# EAGLE design PCB_Breakout (EAGLE 7.1.0)
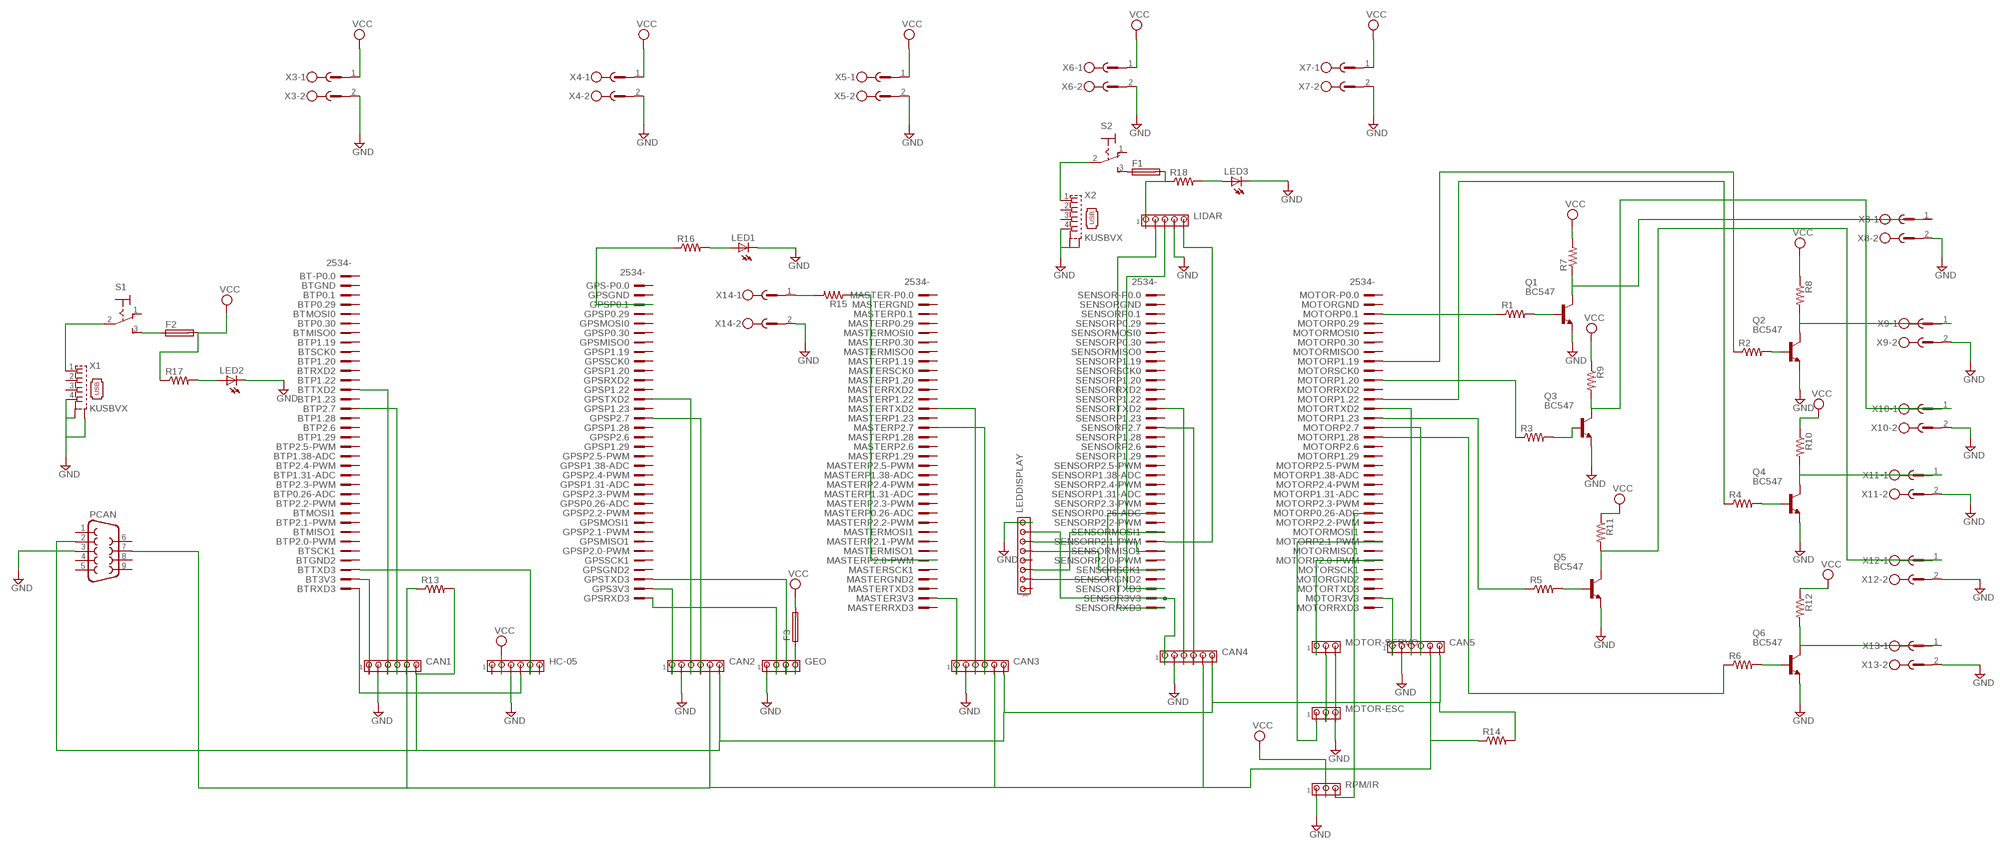
[diagram p0: schematic, sheet 1]

## Parts
BT  2534-  [PAK100/2500-34]
CAN1  MTA06-100  [10X06MTA]
CAN2  MTA06-100  [10X06MTA]
CAN3  MTA06-100  [10X06MTA]
CAN4  MTA06-100  [10X06MTA]
CAN5  MTA06-100  [10X06MTA]
F1  SH22,5  [SH22,5]
F2  SH22,5  [SH22,5]
F3  SH22,5  [SH22,5]
GEO  MTA04-100  [10X04MTA]
GPS  2534-  [PAK100/2500-34]
HC-05  MTA06-100  [10X06MTA]
LED1  LED5MM  [LED5MM]
LED2  LED5MM  [LED5MM]
LED3  LED5MM  [LED5MM]
LEDDISPLAY  MTA08-100  [10X08MTA]
LIDAR  MTA05-100  [10X05MTA]
MASTER  2534-  [PAK100/2500-34]
MOTOR  2534-  [PAK100/2500-34]
MOTOR-ESC  MTA03-100  [10X03MTA]
MOTOR-SERVO  MTA03-100  [10X03MTA]
PCAN  F09HP  [F09HP]
Q1  BC547  [TO92]
Q2  BC547  [TO92]
Q3  BC547  [TO92]
Q4  BC547  [TO92]
Q5  BC547  [TO92]
Q6  BC547  [TO92]
R1  R-US_0207/10  [0207/10]
R2  R-US_0207/10  [0207/10]
R3  R-US_0207/10  [0207/10]
R4  R-US_0207/10  [0207/10]
R5  R-US_0207/10  [0207/10]
R6  R-US_0207/10  [0207/10]
R7  R-US_0207/10  [0207/10]
R8  R-US_0207/10  [0207/10]
R9  R-US_0207/10  [0207/10]
R10  R-US_0207/10  [0207/10]
R11  R-US_0207/10  [0207/10]
R12  R-US_0207/10  [0207/10]
R13  R-US_0207/10  [0207/10]
R14  R-US_0207/10  [0207/10]
R15  R-US_0207/10  [0207/10]
R16  R-US_0207/10  [0207/10]
R17  R-US_0207/10  [0207/10]
R18  R-US_0207/10  [0207/10]
RPM/IR  MTA03-100  [10X03MTA]
S1  M9040P  [M9040P]
S2  M9040P  [M9040P]
SENSOR  2534-  [PAK100/2500-34]
X1  KUSBVX  [KUSBVX]
X2  KUSBVX  [KUSBVX]
X3  MSTBV2  [MSTBV2]
X4  MSTBV2  [MSTBV2]
X5  MSTBV2  [MSTBV2]
X6  MSTBV2  [MSTBV2]
X7  MSTBV2  [MSTBV2]
X8  MSTBV2  [MSTBV2]
X9  MSTBV2  [MSTBV2]
X10  MSTBV2  [MSTBV2]
X11  MSTBV2  [MSTBV2]
X12  MSTBV2  [MSTBV2]
X13  MSTBV2  [MSTBV2]
X14  MSTBV2  [MSTBV2]

## Nets
GND: CAN1.5 CAN2.5 CAN3.5 CAN4.5 CAN5.5 GEO.1 HC-05.4 LED1.K(C) LED2.K(C) LED3.K(C) LEDDISPLAY.8 LIDAR.4 MOTOR-ESC.3 MOTOR-SERVO.3 PCAN.3 Q1.1(E) Q2.1(E) Q3.1(E) Q4.1(E) Q5.1(E) Q6.1(E) RPM/IR.1 X1.4 X1.M1(S1) X1.M2(S2) X2.4 X2.M1(S1) X2.M2(S2) X3.2 X4.2 X5.2 X6.2 X7.2 X8.2 X9.2 X10.2 X11.2 X12.2 X13.2 X14.2
N$1: S2.2(P) X2.1
N$2: BT.33 CAN1.6
N$3: CAN2.6 GPS.33
N$4: CAN3.6 MASTER.33
N$5: CAN4.6 LEDDISPLAY.7 SENSOR.33
N$6: CAN5.6 MOTOR.33
N$7: S1.2(P) X1.1
N$8: F1.2 LIDAR.1 R18.1
N$9: R15.2 X14.1
N$10: MOTOR.3 R1.1
N$11: MOTOR.8 R2.1
N$12: MOTOR.10 R3.1
N$13: MOTOR.12 R4.1
N$14: MOTOR.14 R5.1
N$15: MOTOR.16 R6.1
N$16: Q5.2(B) R5.2
N$17: Q5.3(C) R11.2 X12.1
N$18: Q6.3(C) R12.2 X13.1
N$19: Q6.2(B) R6.2
N$20: Q4.2(B) R4.2
N$21: Q4.3(C) R10.2 X11.1
N$22: Q2.2(B) R2.2
N$23: Q2.3(C) R8.2 X9.1
N$24: Q1.3(C) R7.1 X8.1
N$25: Q1.2(B) R1.2
N$26: Q3.2(B) R3.2
N$27: Q3.3(C) R9.2 X10.1
N$28: MASTER.29 R15.1
N$29: LED2.A R17.2
N$30: BT.13 CAN1.4
N$31: BT.15 CAN1.3
N$32: CAN2.4 GPS.13
N$33: CAN2.3 GPS.15
N$34: CAN3.4 MASTER.13
N$35: CAN3.3 MASTER.15
N$36: CAN4.4 SENSOR.13
N$37: CAN4.3 SENSOR.15
N$38: CAN5.4 MOTOR.13
N$39: CAN5.3 MOTOR.15
N$40: CAN1.2 CAN2.2 CAN3.2 CAN4.2 CAN5.2 PCAN.7 R13.1 R14.1
N$41: LED3.A R18.2
N$42: GPS.3 R16.1
N$43: LED1.A R16.2
N$44: CAN1.1 CAN2.1 CAN3.1 CAN4.1 CAN5.1 PCAN.2 R13.2 R14.2
N$45: F2.1 S1.3(S)
N$46: F1.1 S2.3(S)
N$47: LIDAR.5 SENSOR.27
N$50: MOTOR-SERVO.1 MOTOR.29
N$51: MOTOR-ESC.2 MOTOR-SERVO.2
N$52: MOTOR-ESC.1 MOTOR.27
N$54: MOTOR.24 RPM/IR.3
N$55: LIDAR.2 SENSOR.34
N$56: LIDAR.3 SENSOR.32
N$57: GEO.2 GPS.34
N$58: GEO.3 GPS.32
N$59: BT.34 HC-05.3
N$60: BT.32 HC-05.2
N$64: F3.1 GEO.4
N$65: LEDDISPLAY.2 SENSOR.24
N$66: LEDDISPLAY.3 SENSOR.26
N$67: LEDDISPLAY.5 SENSOR.30
N$68: LEDDISPLAY.6 SENSOR.28
VCC: F2.2 F3.2 HC-05.5 R7.2 R8.1 R9.1 R10.1 R11.1 R12.1 R17.1 RPM/IR.2 X3.1 X4.1 X5.1 X6.1 X7.1
Unconnected: BT.1 BT.2 BT.3 BT.4 BT.5 BT.6 BT.7 BT.8 BT.9 BT.10 BT.11 BT.12 BT.14 BT.16 BT.17 BT.18 BT.19 BT.20 BT.21 BT.22 BT.23 BT.24 BT.25 BT.26 BT.27 BT.28 BT.29 BT.30 BT.31 GPS.1 GPS.2 GPS.4 GPS.5 GPS.6 GPS.7 GPS.8 GPS.9 GPS.10 GPS.11 GPS.12 GPS.14 GPS.16 GPS.17 GPS.18 GPS.19 GPS.20 GPS.21 GPS.22 GPS.23 GPS.24 GPS.25 GPS.26 GPS.27 GPS.28 GPS.29 GPS.30 GPS.31 HC-05.1 HC-05.6 LEDDISPLAY.1 LEDDISPLAY.4 MASTER.1 MASTER.2 MASTER.3 MASTER.4 MASTER.5 MASTER.6 MASTER.7 MASTER.8 MASTER.9 MASTER.10 MASTER.11 MASTER.12 MASTER.14 MASTER.16 MASTER.17 MASTER.18 MASTER.19 MASTER.20 MASTER.21 MASTER.22 MASTER.23 MASTER.24 MASTER.25 MASTER.26 MASTER.27 MASTER.28 MASTER.30 MASTER.31 MASTER.32 MASTER.34 MOTOR.1 MOTOR.2 MOTOR.4 MOTOR.5 MOTOR.6 MOTOR.7 MOTOR.9 MOTOR.11 MOTOR.17 MOTOR.18 MOTOR.19 MOTOR.20 MOTOR.21 MOTOR.22 MOTOR.23 MOTOR.25 MOTOR.26 MOTOR.28 MOTOR.30 MOTOR.31 MOTOR.32 MOTOR.34 PCAN.1 PCAN.4 PCAN.5 PCAN.6 PCAN.8 PCAN.9 S1.1(O) S2.1(O) SENSOR.1 SENSOR.2 SENSOR.3 SENSOR.4 SENSOR.5 SENSOR.6 SENSOR.7 SENSOR.8 SENSOR.9 SENSOR.10 SENSOR.11 SENSOR.12 SENSOR.14 SENSOR.16 SENSOR.17 SENSOR.18 SENSOR.19 SENSOR.20 SENSOR.21 SENSOR.22 SENSOR.23 SENSOR.25 SENSOR.29 SENSOR.31 X1.2 X1.3 X2.2 X2.3

## Library data of the parts
BT GPS MASTER MOTOR SENSOR = con-3m:2534-: 3M (TM) Pak 100 4-Wall Header Source: 3M; OC_FARNELL: unknown; OC_NEWARK: unknown
CAN1-CAN5 HC-05 = con-amp:MTA06-100: AMP connector
F1-F3 = fuse:SH22,5: FUSE HOLDER grid 22,5 mm, OGN0031 8201, Schurter (Buerklin); MF: SCHURTER; MPN: 0031.8201; OC_FARNELL: 1162740; OC_NEWARK: 96F8317
GEO = con-amp:MTA04-100: AMP connector
LED1-LED3 = led:LED: LED OSRAM: - CHIPLED LG R971, LG N971, LY N971, LG Q971, LY Q971, LO R971, LY R971 LH N974, LH R974 LS Q976, LO Q976, LY Q976 LO Q996 - Hyper CHIPLED LW Q18S LB Q993, LB Q99A, LB R99A - SideLED LS A670, LO A670, LY A670, LG A670, LP A670 LB A673, LV A673, LT A673, LW A673 LH A674 LY A675 LS A676, LA A676, LO A676, LY A676, LW A676 LS A679, LY A679, LG A679 - Hyper Micro SIDELED® LS Y876, LA Y876, LO Y876, LY Y876 LT Y87S - SmartLED LW L88C, LW L88S LB L89C, LB L89S, LG L890 LS L89K, LO L89K, LY L89K LS L896, LA L896, LO L896, LY L896 - TOPLED LS T670, LO T670, LY T670, LG T670, LP T670 LSG T670, LSP T670, LSY T670, LOP T670, LYG T670 LG T671, LOG T671, LSG T671 LB T673, LV T673, LT T673, LW T673 LH T674 LS T676, LA T676, LO T676, LY T676, LB T676, LH T676, LSB T676, LW T676 LB T67C, LV T67C, LT T67C, LS T67K, LO T67K, LY T67K, LW E67C LS E67B, LA E67B, LO E67B, LY E67B, LB E67C, LV E67C, LT E67C LW T67C LS T679, LY T679, LG T679 LS T770, LO T770, LY T770, LG T770, LP T770 LB T773, LV T773, LT T773, LW T773 LH T774 LS E675, LA E675, LY E675, LS T675 LS T776, LA T776, LO T776, LY T776, LB T776 LHGB T686 LT T68C, LB T68C - Hyper Mini TOPLED® LB M676 - Mini TOPLED Santana® LG M470 LS M47K, LO M47K, LY M47K Source: http://www.osram.convergy.de LUXEON: - LUMILED® LXK2-PW12-R00, LXK2-PW12-S00, LXK2-PW14-U00, LXK2-PW14-V00 LXK2-PM12-R00, LXK2-PM12-S00, LXK2-PM14-U00 LXK2-PE12-Q00, LXK2-PE12-R00, LXK2-PE12-S00, LXK2-PE14-T00, LXK2-PE14-U00 LXK2-PB12-K00, LXK2-PB12-L00, LXK2-PB12-M00, LXK2-PB14-N00, LXK2-PB14-P00, LXK2-PB14-Q00 LXK2-PR12-L00, LXK2-PR12-M00, LXK2-PR14-Q00, LXK2-PR14-R00 LXK2-PD12-Q00, LXK2-PD12-R00, LXK2-PD12-S00 LXK2-PH12-R00, LXK2-PH12-S00 LXK2-PL12-P00, LXK2-PL12-Q00, LXK2-PL12-R00 Source: www.luxeon.com KINGBRIGHT: KA-3528ASYC Source: www.kingbright.com
LEDDISPLAY = con-amp:MTA08-100: AMP connector
LIDAR = con-amp:MTA05-100: AMP connector
MOTOR-ESC MOTOR-SERVO RPM/IR = con-amp:MTA03-100: AMP connector
PCAN = con-subd:F09: SUB-D; OC_FARNELL: unknown; OC_NEWARK: unknown
Q1-Q6 = transistor-npn:BC547*: NPN Transistor
R1-R18 = rcl:R-US_: RESISTOR, American symbol
S1 S2 = switch:M9040P: TOGGLE SWITCH Marquardt
X1 X2 = con-kycon:KUSBVX: Vertical,Top Entry Universal Serial Bus Connector KUSBVX Series Source: KYCON Sibalco USB vertical socket KUSBV.pdf
X3-X14 = con-phoenix-500:MSTBV2: PHOENIX; OC_FARNELL: unknown; OC_NEWARK: unknown

## Board
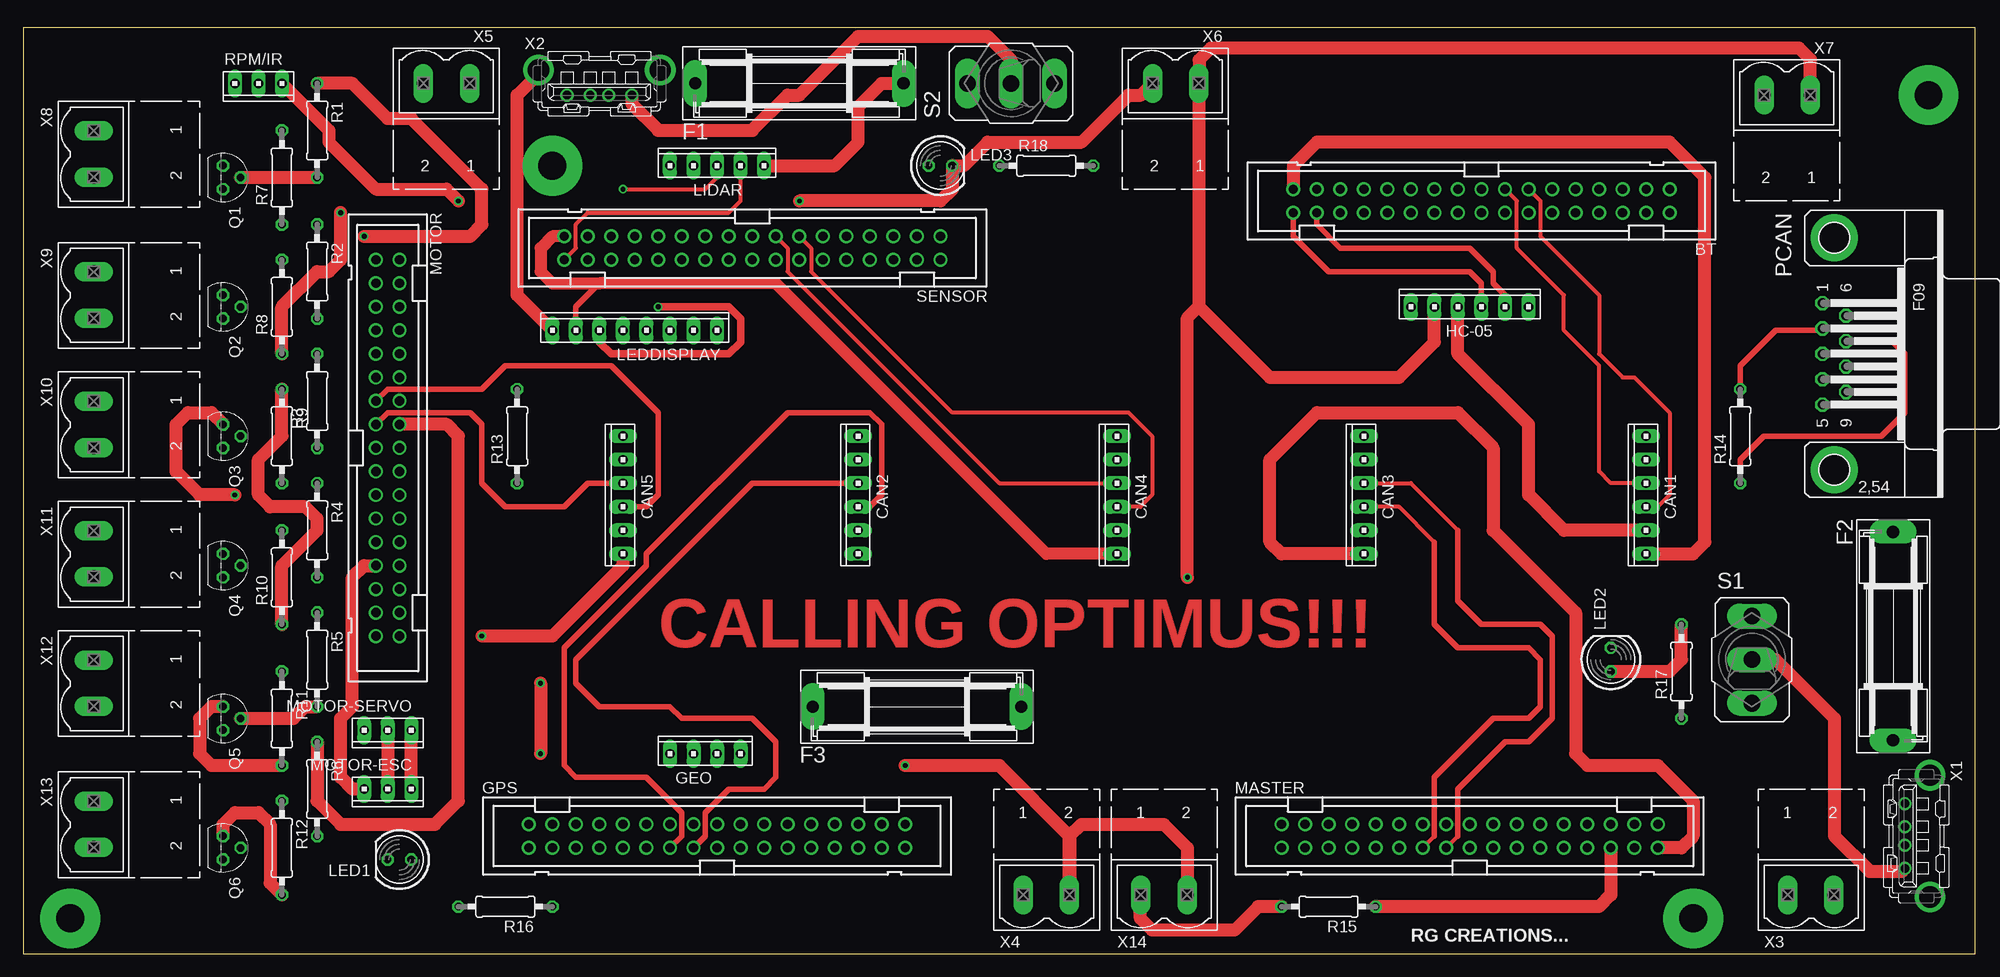
[diagram p1: board, top side]
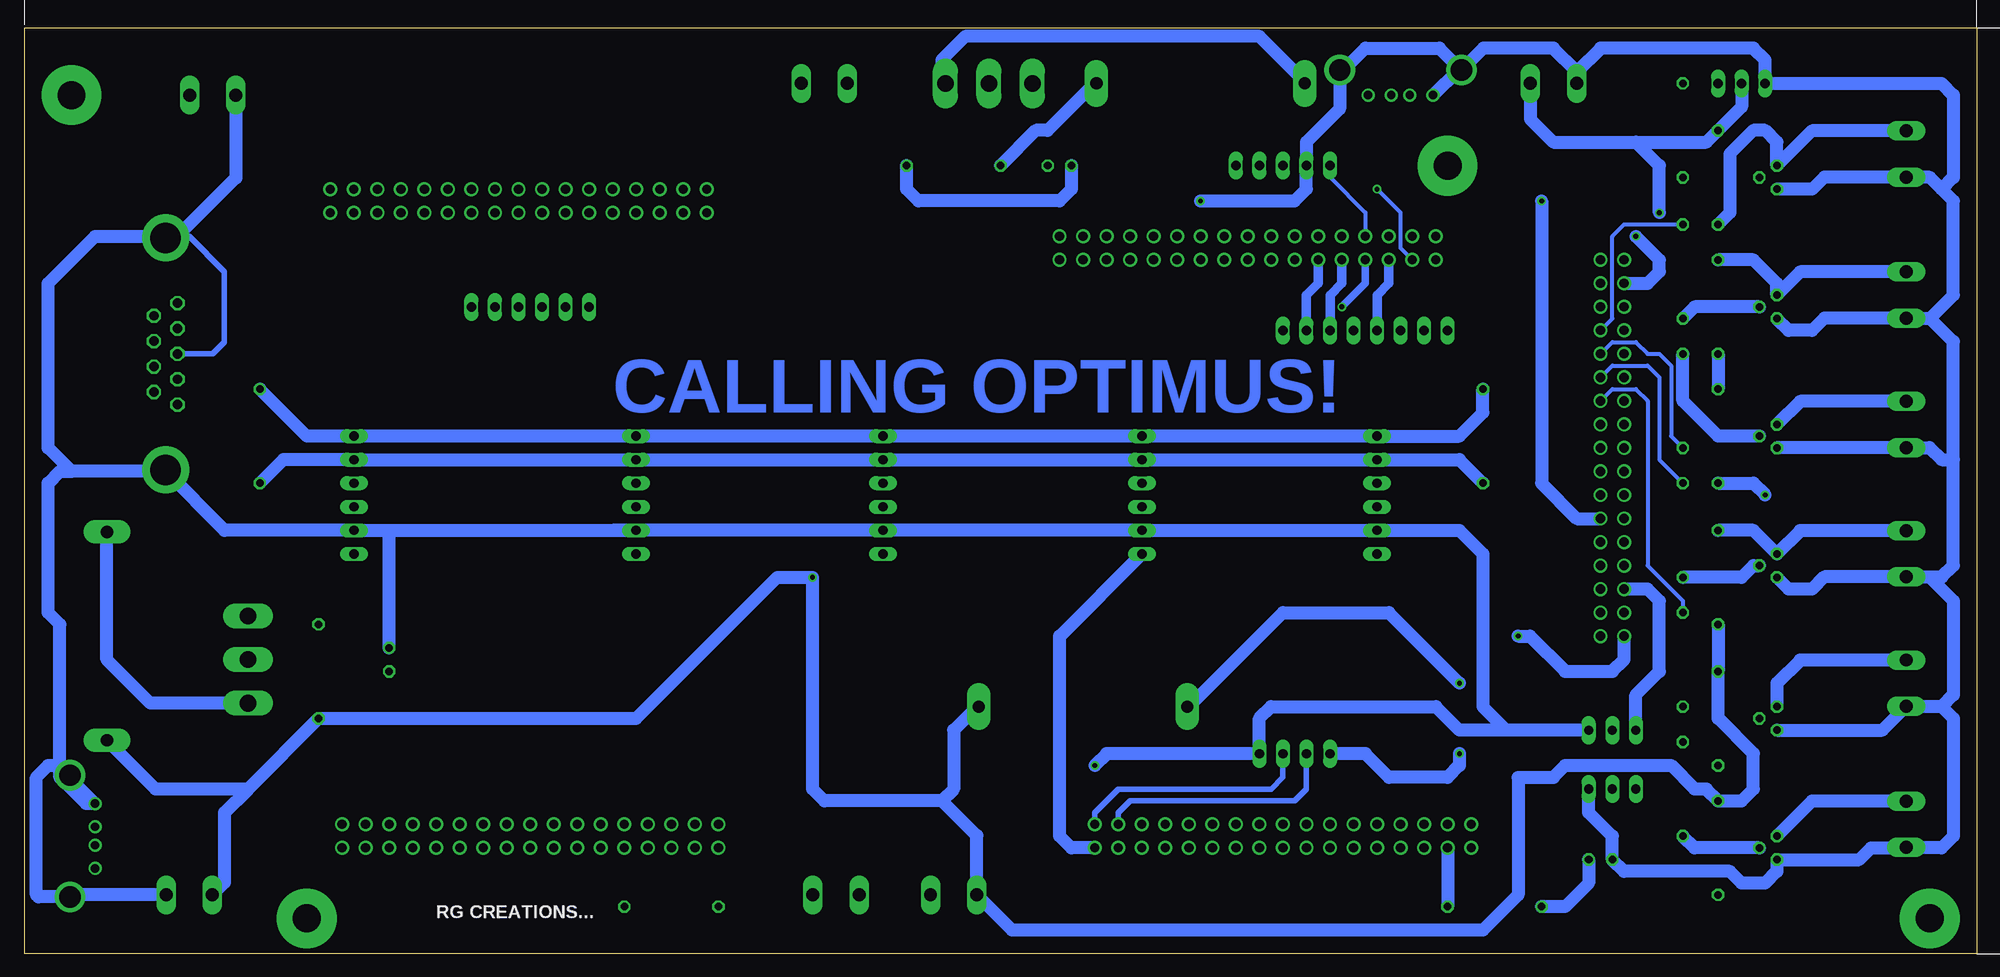
[diagram p2: board, bottom side, seen from below]

Size 210.8 x 100 mm. Coordinates in mm from the lower left corner, seen from the top.
Outline: 0,0 210.8,0 210.8,100 0,100 0,0
Copper layers (1*16): Top 0.035mm / dielectric 1.5mm / Bottom 0.035mm
Design rules "default": minimum track width 10mil, minimum drill 24mil, track to track 8mil, track to pad 8mil, pad to pad 8mil, via to via 8mil, smd to smd 8mil, copper to edge 40mil, drill to drill 8mil, minimum pad ring 10mil, minimum via ring 8mil, stop-mask expansion 4mil, vias tented up to drill 0mil, thermal gap 10mil

### Footprints (pad centres in the part's own frame; a part is rotated, then mirrored left to right if it is on the bottom)
PAK100/2500-34 = drill 1 pad 1.422: 1 -20.32,-1.27; 2 -20.32,1.27; 3 -17.78,-1.27; 4 -17.78,1.27; 5 -15.24,-1.27; 6 -15.24,1.27; 7 -12.7,-1.27; 8 -12.7,1.27; 9 -10.16,-1.27; 10 -10.16,1.27; 11 -7.62,-1.27; 12 -7.62,1.27; 13 -5.08,-1.27; 14 -5.08,1.27; 15 -2.54,-1.27; 16 -2.54,1.27; 17 0,-1.27; 18 0,1.27; 19 2.54,-1.27; 20 2.54,1.27; 21 5.08,-1.27; 22 5.08,1.27; 23 7.62,-1.27; 24 7.62,1.27; 25 10.16,-1.27; 26 10.16,1.27; 27 12.7,-1.27; 28 12.7,1.27; 29 15.24,-1.27; 30 15.24,1.27; 31 17.78,-1.27; 32 17.78,1.27; 33 20.32,-1.27; 34 20.32,1.27
10X06MTA = drill 1.016 long: 1 6.35,0; 2 3.81,0; 3 1.27,0; 4 -1.27,0; 5 -3.81,0; 6 -6.35,0
SH22,5 = drill 1.321 pad 2.54 long: 1 -11.252,0; 2 11.252,0
10X04MTA = drill 1.016 long: 1 3.81,0; 2 1.27,0; 3 -1.27,0; 4 -3.81,0
LED5MM = drill 0.813 octagon: A -1.27,0; K 1.27,0
10X08MTA = drill 1.016 long: 1 8.89,0; 2 6.35,0; 3 3.81,0; 4 1.27,0; 5 -1.27,0; 6 -3.81,0; 7 -6.35,0; 8 -8.89,0
10X05MTA = drill 1.016 long: 1 5.08,0; 2 2.54,0; 3 0,0; 4 -2.54,0; 5 -5.08,0
10X03MTA = drill 1.016 long: 1 2.54,0; 2 0,0; 3 -2.54,0
F09HP = drill 1.016 octagon: 1 -5.486,-1.27; 2 -2.743,-1.27; 3 0,-1.27; 4 2.743,-1.27; 5 5.486,-1.27; 6 -4.115,1.27; 7 -1.372,1.27; 8 1.372,1.27; 9 4.115,1.27 | drill 3.302 pad 5.08: G1 -12.522,0; G2 12.522,0
TO92 = drill 0.813 octagon: 1 1.27,0; 2 0,1.905; 3 -1.27,0
0207/10 = drill 0.813 octagon: 1 -5.08,0; 2 5.08,0
M9040P = drill 1.803 long: 1 0,4.699; 2 0,0; 3 0,-4.699
KUSBVX = drill 0.9 pad 1.3: 1 3.5,0; 2 1,0; 3 -1,0; 4 -3.5,0 | drill 2.3 pad 2.8: M1 -6.57,2.71; M2 6.57,2.71
MSTBV2 = drill 1.397 long: 1 -2.5,0; 2 2.5,0

### Placement (x,y rotation side)
BT  157.48,81.28 180 top
CAN1  175.26,49.53 90 top
CAN2  90.17,49.53 90 top
CAN3  144.78,49.53 90 top
CAN4  118.11,49.53 90 top
CAN5  64.77,49.53 90 top
F1  83.82,93.98 0 top
F2  201.93,34.29 270 top
F3  96.52,26.67 0 top
GEO  73.66,21.59 0 top
GPS  74.93,12.7 0 top
HC-05  156.21,69.85 0 top
LED1  40.64,10.16 180 top
LED2  171.45,31.75 90 top
LED3  99.06,85.09 0 top
LEDDISPLAY  66.04,67.31 0 top
LIDAR  74.93,85.09 0 top
MASTER  156.21,12.7 0 top
MOTOR  39.37,54.61 270 top
MOTOR-ESC  39.37,17.78 180 top
MOTOR-SERVO  39.37,24.13 180 top
PCAN  195.58,64.77 270 top
Q1  21.59,83.82 270 top
Q2  21.59,69.85 270 top
Q3  21.59,55.88 270 top
Q4  21.59,41.91 270 top
Q5  21.59,25.4 270 top
Q6  21.59,11.43 270 top
R1  31.75,88.9 270 top
R2  31.75,73.66 270 top
R3  31.75,59.69 90 top
R4  31.75,45.72 270 top
R5  31.75,31.75 270 top
R6  31.75,17.78 270 top
R7  27.94,83.82 90 top
R8  27.94,69.85 90 top
R9  27.94,55.88 270 top
R10  27.94,40.64 90 top
R11  27.94,25.4 270 top
R12  27.94,11.43 270 top
R13  53.34,55.88 90 top
R14  185.42,55.88 90 top
R15  140.97,5.08 180 top
R16  52.07,5.08 180 top
R17  179.07,30.48 90 top
R18  110.49,85.09 0 top
RPM/IR  25.4,93.98 180 top
S1  186.69,31.75 0 top
S2  106.68,93.98 90 top
SENSOR  78.74,76.2 180 top
X1  203.2,12.7 270 top
X2  62.23,92.71 0 top
X3  193.04,6.35 0 top
X4  110.49,6.35 0 top
X5  45.72,93.98 180 top
X6  124.46,93.98 180 top
X7  190.5,92.71 180 top
X8  7.62,86.36 270 top
X9  7.62,71.12 270 top
X10  7.62,57.15 270 top
X11  7.62,43.18 270 top
X12  7.62,29.21 270 top
X13  7.62,13.97 270 top
X14  123.19,6.35 0 top

### Tracks (layer width: path | path; a pad name or v marks a point on that pad's centre or on a via)
GND  (via drill 0.51)
  Top 1.422: MOTOR-ESC.3 MOTOR-SERVO.3 | X6.2 120.69,92.71 119.38,92.71 114.3,87.63 104.14,87.63 101.6,85.09 LED3.K 100.33,82.55 99.06,81.28 v83.82,81.28 | v95.25,20.32 105.41,20.32 113.03,12.7 113.03,6.39 X4.2 112.99,12.66 114.3,13.97 123.19,13.97 125.73,11.43 125.73,6.39 X14.2 | CAN1.5 166.37,45.72 162.56,49.53 162.56,57.15 154.94,64.77 HC-05.4 | LEDDISPLAY.8 53.34,71.12 53.34,92.71 55.88,95.25 55.83,95.25 X2.M1
  Bottom 0.61: 195.58,77.47 194.31,77.47 193.04,77.47 189.23,73.66 189.23,66.04 190.5,64.77 PCAN.3
  Bottom 1.422: Q1.1 17.78,82.55 16.47,83.86 X8.2 7.58,83.82 5.08,83.82 3.81,82.55 | Q2.1 20.32,67.31 17.78,67.31 16.47,68.62 X9.2 5.08,68.62 | Q3.1 21.55,54.65 X10.2 5.12,54.65 3.81,53.34 2.54,53.34 | X11.2 16.47,40.68 17.78,39.37 20.32,39.37 Q4.1 | 5.08,68.62 5.04,68.62 2.54,71.12 2.54,81.28 3.81,82.55 | X11.2 3.77,40.68 2.54,41.91 2.54,53.34 | 2.54,53.34 2.54,66.08 5.08,68.62 | X11.2 5.12,40.68 2.54,38.1 2.54,27.94 3.81,26.67 7.58,26.67 X12.2 | X12.2 3.85,26.71 2.54,25.4 2.54,12.7 3.81,11.43 7.58,11.43 X13.2 7.66,11.43 11.43,11.43 12.7,10.16 Q6.1 21.59,8.89 22.86,7.62 25.4,7.62 26.67,8.89 38.1,8.89 LED1.K 39.37,12.7 41.91,15.24 MOTOR-ESC.3 | Q5.1 10.2,24.13 X12.2 | MOTOR-SERVO.3 50.8,24.13 | 50.8,24.13 55.88,24.13 58.42,26.67 76.2,26.67 77.47,25.4 GEO.1 93.98,21.59 v95.25,20.32 | 3.81,82.55 2.54,83.82 2.54,92.71 3.81,93.98 RPM/IR.1 22.86,96.52 24.13,97.79 40.64,97.79 43.18,95.25 43.18,94.02 X5.2 43.22,95.29 45.72,97.79 53.29,97.79 X2.M1 | X2.M1 56.02,95.42 X2.4 | X2.M1 58.03,97.79 66.04,97.79 68.41,95.42 X2.M2 68.8,91.22 72.39,87.63 LIDAR.4 72.39,82.55 73.66,81.28 v83.82,81.28 | CAN3.5 CAN4.5 CAN2.5 CAN5.5 55.88,45.72 53.34,43.18 53.34,26.67 50.8,24.13 | CAN3.5 147.32,45.72 | 171.45,45.72 CAN1.5 189.23,45.72 195.58,52.07 205.74,52.07 | 171.45,45.72 CAN3.5 | LED2.K 171.45,45.72 | X3.2 206.13,6.35 | 207.01,6.35 206.13,6.35 | 206.13,6.35 X1.M2 209.33,6.13 209.55,6.35 209.55,19.05 208.28,20.32 206.96,20.32 X1.M1 205.91,18.91 X1.4 204.16,16.2 207.01,19.05 207.01,35.56 208.28,36.83 208.28,50.8 207.01,52.07 205.74,52.07 | 205.74,52.07 208.28,54.61 208.28,72.39 203.2,77.47 195.58,77.47
  Bottom 1.422: X7.2 188,83.78 194.31,77.47
N$1
  Top 1.422: X2.1 65.73,91.75 68.58,88.9 78.74,88.9 82.55,92.71 83.82,92.71 90.17,99.06 104.14,99.06 106.68,96.52 S2.2
N$2
  Top 1.422: CAN1.6 180.34,43.18 181.61,44.45 181.61,83.82 177.8,87.63 139.7,87.63 137.16,85.09 BT.33
N$3
  Bottom 1.422: GPS.33 97.79,11.43 99.06,12.7 99.06,34.29 CAN2.6
N$4
  Top 1.422: CAN3.6 135.89,43.18 134.62,44.45 134.62,53.34 139.7,58.42 154.94,58.42 158.75,54.61 158.75,45.72 167.64,36.83 167.64,21.59 168.91,20.32 176.53,20.32 180.34,16.51 180.34,12.7 179.07,11.43 MASTER.33
N$5
  Top 0.61: LEDDISPLAY.7 59.69,69.85 62.23,72.39
  Top 1.27: CAN4.6 110.49,43.18 81.28,72.39 62.23,72.39 57.15,72.39 55.88,73.66 55.88,76.2 57.15,77.47 SENSOR.33
N$6  (via drill 0.51)
  Top 1.422: CAN5.6 64.77,41.91 57.15,34.29 v49.53,34.29
  Bottom 1.422: v49.53,34.29 48.26,34.29 44.45,30.48 39.37,30.48 38.1,31.75 MOTOR.33
N$7
  Top 1.422: S1.2 189.23,31.75 195.58,25.4 195.58,12.7 199.39,8.89 202.89,8.89 X1.1
N$8
  Top 1.422: LIDAR.1 87.63,85.09 90.17,87.63 90.17,91.44 92.71,93.98 F1.2
  Bottom 1.422: F1.2 95.25,93.98 100.33,88.9 101.6,88.9 R18.1
N$9
  Top 1.422: R15.2 133.35,5.08 130.81,2.54 121.92,2.54 120.65,3.81 120.65,6.35 X14.1
N$10  (via drill 0.51)
  Top 1.422: v36.83,77.47 48.26,77.47 49.53,78.74 49.53,82.55 41.91,90.17 39.37,90.17 35.56,93.98 R1.1
  Bottom 1.422: MOTOR.3 35.56,72.39 34.29,73.66 34.29,74.93 v36.83,77.47
N$11
  Bottom 0.406: MOTOR.8 39.37,68.58 39.37,77.47 38.1,78.74 R2.1
N$12
  Bottom 0.406: MOTOR.10 39.37,66.04 36.83,66.04 35.56,64.77 34.29,64.77 33.02,63.5 33.02,55.88 R3.1
N$13
  Bottom 0.406: MOTOR.12 39.37,63.5 35.56,63.5 34.29,62.23 34.29,53.34 R4.1
N$14
  Bottom 0.406: MOTOR.14 39.37,60.96 36.83,60.96 35.56,59.69 35.56,41.91 31.75,38.1 R5.1
N$15
  Top 1.422: R6.1 31.75,16.51 34.29,13.97 44.45,13.97 46.99,16.51 46.99,55.88 45.72,57.15 MOTOR.16
N$16
  Top 1.422: Q5.2 29.21,25.4 30.48,26.67 R5.2
N$17
  Top 1.422: Q5.3 20.32,26.67 19.05,25.4 19.05,21.59 20.32,20.32 R11.2
  Bottom 1.422: X12.1 19.09,31.71 21.59,29.21 Q5.3
N$18
  Top 1.422: Q6.3 21.59,13.97 22.86,15.24 25.4,15.24 26.67,13.97 26.67,7.62 R12.2
  Bottom 1.422: X13.1 17.82,16.47 Q6.3
N$19
  Bottom 1.422: Q6.2 30.48,11.43 R6.2
N$20
  Bottom 1.422: R4.2 25.4,40.64 24.13,41.91 Q4.2
N$21
  Bottom 1.422: X11.1 19.09,45.68 Q4.3 24.13,45.72 R10.2
N$22
  Bottom 1.422: Q2.2 30.48,69.85 R2.2
N$23
  Bottom 1.422: X9.1 19.09,73.62 Q2.3 21.59,72.39 24.13,74.93 R8.2
N$24
  Bottom 1.422: X8.1 17.82,88.86 Q1.3 21.59,87.63 22.86,88.9 24.13,88.9 26.67,86.36 26.67,80.01 R7.1
N$25
  Top 1.422: Q1.2 R1.2
N$26
  Bottom 1.422: Q3.2 27.94,55.88 31.75,59.69 R3.2
N$27  (via drill 0.51)
  Top 1.422: v22.86,49.53 19.05,49.53 16.51,52.07 16.51,57.15 17.78,58.42 20.32,58.42 Q3.3
  Bottom 1.422: X10.1 19.09,59.65 Q3.3 | R9.2 24.13,50.8 v22.86,49.53
N$28
  Top 1.422: MASTER.29 171.45,6.35 170.18,5.08 R15.1
N$29
  Top 1.422: LED2.A 177.8,30.48 179.07,31.75 R17.2
N$30
  Top 0.406: BT.13 163.83,81.28 163.83,77.47 170.18,71.12 170.18,64.77 172.72,62.23 173.99,62.23 177.8,58.42 177.8,49.53 176.53,48.26 CAN1.4
N$31
  Top 0.406: CAN1.3 171.45,50.8 170.18,52.07 170.18,63.5 166.37,67.31 166.37,71.12 161.29,76.2 161.29,81.28 BT.15
N$32
  Top 0.61: GPS.13 71.12,12.7 71.12,15.24 67.31,19.05 59.69,19.05 58.42,20.32 58.42,33.02 67.31,41.91 67.31,43.18 82.55,58.42 91.44,58.42 92.71,57.15 92.71,49.53 91.44,48.26 CAN2.4
N$33
  Top 0.61: CAN2.3 78.74,50.8 59.69,31.75 59.69,29.21 62.23,26.67 69.85,26.67 71.12,25.4 78.74,25.4 81.28,22.86 81.28,19.05 80.01,17.78 76.2,17.78 73.66,15.24 73.66,12.7 GPS.15
N$34
  Top 0.406: MASTER.13 152.4,12.7 | 152.4,44.45 148.59,48.26 CAN3.4
  Top 0.61: 152.4,44.45 152.4,35.56 154.94,33.02 162.56,33.02 163.83,31.75 163.83,26.67 162.56,25.4 158.75,25.4 152.4,19.05 152.4,12.7
N$35
  Top 0.406: CAN3.3 149.86,50.8 154.94,45.72 | 154.94,12.7 MASTER.15
  Top 0.61: 154.94,12.7 154.94,17.78 160.02,22.86 162.56,22.86 165.1,25.4 165.1,34.29 163.83,35.56 157.48,35.56 154.94,38.1 154.94,45.72
N$36
  Top 0.406: SENSOR.13 85.09,76.2 85.09,73.66 100.33,58.42 119.38,58.42 121.92,55.88 121.92,49.53 120.65,48.26 CAN4.4
N$37
  Top 0.406: SENSOR.15 82.55,76.2 82.55,73.66 105.41,50.8 CAN4.3
N$38
  Top 0.61: MOTOR.13 39.37,60.96 49.53,60.96 52.07,63.5 63.5,63.5 68.58,58.42 68.58,49.53 67.31,48.26 CAN5.4
N$39
  Top 0.61: CAN5.3 60.96,50.8 58.42,48.26 52.07,48.26 49.53,50.8 49.53,57.15 48.26,58.42 39.37,58.42 MOTOR.15
N$40
  Top 0.61: PCAN.7 201.83,66.14 203.2,64.77 203.2,58.42 200.66,55.88 187.96,55.88 185.42,53.34 R14.1
  Bottom 1.422: R13.1 55.88,53.34 CAN5.2 CAN2.2 CAN4.2 CAN3.2 CAN1.2 182.88,53.34 R14.1
N$41
  Bottom 1.422: LED3.A 97.79,82.55 99.06,81.28 114.3,81.28 115.57,82.55 R18.2
N$42
  Bottom 1.422: GPS.3 R16.1
N$43
  Bottom 1.422: LED1.A 41.91,7.62 44.45,5.08 R16.2
N$44
  Top 0.61: R14.2 185.42,63.5 189.23,67.31 194.11,67.31 PCAN.2
  Bottom 1.422: R13.2 53.34,58.42 55.88,55.88 CAN5.1 CAN2.1 CAN4.1 CAN3.1 CAN1.1 180.34,55.88 R14.2
N$45
  Bottom 1.422: S1.3 197.23,27.05 201.93,31.75 F2.1
N$46
  Bottom 1.422: F1.1 72.57,94.16 77.47,99.06 109.22,99.06 111.76,96.52 111.76,93.98 S2.3
N$47
  Bottom 0.406: LIDAR.5 69.85,83.82 66.04,80.01 SENSOR.27
N$49  (via drill 3 pad 6.45)
  other vias: 57.15,85.09
N$50
  Bottom 1.422: MOTOR-SERVO.1 36.83,27.94 34.29,30.48 34.29,38.1 35.56,39.37 MOTOR.29
N$51
  Top 1.422: MOTOR-SERVO.2 MOTOR-ESC.2
N$52
  Top 1.422: MOTOR-ESC.1 35.56,17.78 34.29,19.05 34.29,25.4 35.56,26.67 35.56,40.64 36.83,41.91 MOTOR.27
N$54  (via drill 0.51)
  Top 1.422: RPM/IR.3 33.02,88.9 33.02,87.63 38.1,82.55 45.72,82.55 v46.99,81.28
  Bottom 1.422: v46.99,81.28 46.99,50.8 43.18,46.99 MOTOR.24
N$55
  Top 0.406: SENSOR.34 59.69,76.2 59.69,78.74 60.96,80.01 76.2,80.01 77.47,81.28 LIDAR.2
N$56  (via drill 0.51)
  Top 0.406: v64.77,82.55 73.66,82.55 74.93,83.82 LIDAR.3
  Bottom 0.406: SENSOR.32 62.23,76.2 62.23,80.01 v64.77,82.55
N$57
  Bottom 0.61: GEO.2 74.93,19.05 76.2,17.78 92.71,17.78 95.25,15.24 GPS.34
N$58
  Bottom 0.61: GEO.3 72.39,17.78 73.66,16.51 91.44,16.51 92.71,15.24 GPS.32
N$59
  Top 0.61: BT.34 137.16,77.47 140.97,73.66 156.21,73.66 157.48,72.39 HC-05.3
N$60
  Top 0.61: HC-05.2 160.02,71.12 158.75,72.39 158.75,73.66 156.21,76.2 142.24,76.2 139.7,78.74 BT.32
N$61  (via drill 3 pad 6.45)
  other vias: 205.74,92.71
N$62  (via drill 3 pad 6.45)
  other vias: 5.08,3.81
N$63  (via drill 3 pad 6.45)
  other vias: 180.34,3.81
N$64  (via drill 0.51)
  Top 1.422: v55.88,29.21 v55.88,21.59
  Bottom 1.422: F3.1 85.09,26.67 74.93,36.83 63.5,36.83 v55.88,29.21 | v55.88,21.59 55.88,20.32 57.15,19.05 63.5,19.05 66.04,21.59 GEO.4
N$65
  Bottom 1.016: LEDDISPLAY.2 72.39,71.12 71.12,72.39 SENSOR.24
N$66
  Bottom 1.016: LEDDISPLAY.3 69.85,71.12 68.58,72.39 SENSOR.26
N$67
  Bottom 1.016: LEDDISPLAY.5 64.77,71.12 63.5,72.39 SENSOR.30
N$68  (via drill 0.51)
  Top 0.813: LEDDISPLAY.6 62.23,66.04 63.5,64.77 76.2,64.77 77.47,66.04 77.47,68.58 76.2,69.85 v68.58,69.85
  Bottom 0.813: v68.58,69.85 66.04,72.39 SENSOR.28
VCC  (via drill 0.51)
  Top 1.422: R10.1 27.94,41.91 31.75,45.72 31.75,46.99 30.48,48.26 26.67,48.26 25.4,49.53 25.4,53.34 27.94,55.88 R9.1 | R8.1 27.94,69.85 31.75,73.66 33.02,73.66 34.29,74.93 v34.29,80.01 | 126.96,69.89 X6.1 127,94.02 127,96.52 128.27,97.79 191.77,97.79 193,96.56 X7.1 | 126.96,69.89 134.62,62.23 148.59,62.23 152.4,66.04 HC-05.5 | v125.73,40.64 125.73,68.66 126.96,69.89
  Bottom 1.422: R10.1 R11.1 27.94,25.4 24.13,21.59 24.13,17.78 25.4,16.51 R12.1 29.21,17.78 30.48,17.78 33.02,20.32 44.45,20.32 45.72,19.05 49.53,19.05 49.53,6.35 53.34,2.54 104.18,2.54 X4.1 107.99,12.74 111.76,16.51 | RPM/IR.2 25.4,91.44 R7.2 29.21,87.63 36.83,87.63 | X5.1 48.22,90.13 45.72,87.63 36.83,87.63 | R8.1 R9.1 | v34.29,80.01 34.29,85.09 36.83,87.63 | 186.69,17.78 189.23,15.24 189.23,7.66 X3.1 | 186.69,17.78 R17.1 144.78,25.4 129.54,40.64 v125.73,40.64 125.73,17.78 124.46,16.51 111.76,16.51 | 186.69,17.78 196.67,17.78 F2.2 | F3.2 107.95,26.67 110.49,24.13 110.49,17.78 111.76,16.51

### Text on the board
Top: CALLING OPTIMUS!!!
Bottom: CALLING OPTIMUS!
tNames: RG CREATIONS...
bNames: RG CREATIONS...